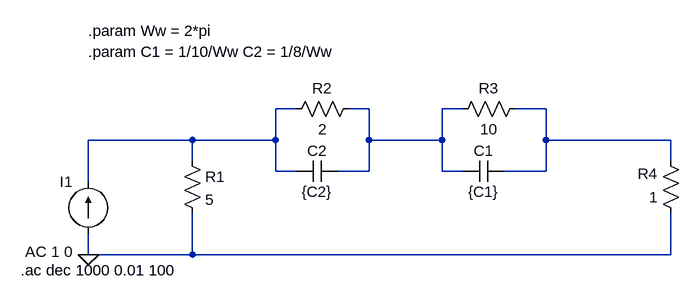
[diagram p0: schematic TS12E1.asc]
TS12E1.asc, the LTspice schematic file:
Version 4
SHEET 1 880 680
WIRE 224 64 192 64
WIRE 336 64 304 64
WIRE 480 64 448 64
WIRE 608 64 560 64
WIRE 64 112 -96 112
WIRE 192 112 192 64
WIRE 192 112 64 112
WIRE 336 112 336 64
WIRE 448 112 448 64
WIRE 448 112 336 112
WIRE 608 112 608 64
WIRE 800 112 608 112
WIRE 64 144 64 112
WIRE 800 144 800 112
WIRE 192 160 192 112
WIRE 224 160 192 160
WIRE 336 160 336 112
WIRE 336 160 288 160
WIRE 448 160 448 112
WIRE 480 160 448 160
WIRE 608 160 608 112
WIRE 608 160 544 160
WIRE -96 176 -96 112
WIRE -96 288 -96 256
WIRE 64 288 64 224
WIRE 64 288 -96 288
WIRE 800 288 800 224
WIRE 800 288 64 288
FLAG -96 288 0
SYMBOL res 48 128 R0
SYMATTR InstName R1
SYMATTR Value 5
SYMBOL res 320 48 R90
WINDOW 0 0 56 VBottom 2
WINDOW 3 32 56 VTop 2
SYMATTR InstName R2
SYMATTR Value 2
SYMBOL res 576 48 R90
WINDOW 0 0 56 VBottom 2
WINDOW 3 32 56 VTop 2
SYMATTR InstName R3
SYMATTR Value 10
SYMBOL res 816 240 R180
WINDOW 0 36 76 Left 2
WINDOW 3 36 40 Left 2
SYMATTR InstName R4
SYMATTR Value 1
SYMBOL cap 544 144 R90
WINDOW 0 0 32 VBottom 2
WINDOW 3 32 32 VTop 2
SYMATTR InstName C1
SYMATTR Value {C1}
SYMBOL cap 288 144 R90
WINDOW 0 0 32 VBottom 2
WINDOW 3 32 32 VTop 2
SYMATTR InstName C2
SYMATTR Value {C2}
SYMBOL current -96 256 R180
WINDOW 0 24 80 Left 2
WINDOW 3 24 0 Left 2
WINDOW 123 24 -28 Left 2
WINDOW 39 0 0 Left 0
SYMATTR InstName I1
SYMATTR Value ""
SYMATTR Value2 AC 1 0
TEXT -96 -56 Left 2 !.param Ww = 2*pi
TEXT -96 -24 Left 2 !.param C1 = 1/10/Ww C2 = 1/8/Ww
TEXT -200 312 Left 2 !.ac dec 1000 0.01 100

The netlist it stands for:
* TS12E1.asc
R1 N001 0 5
R2 N002 N001 2
R3 N003 N002 10
R4 0 N003 1
C1 N003 N002 {C1}
C2 N002 N001 {C2}
I1 0 N001 AC 1 0
.param Ww = 2*pi
.param C1 = 1/10/Ww C2 = 1/8/Ww
.ac dec 1000 0.01 100
.backanno
.end